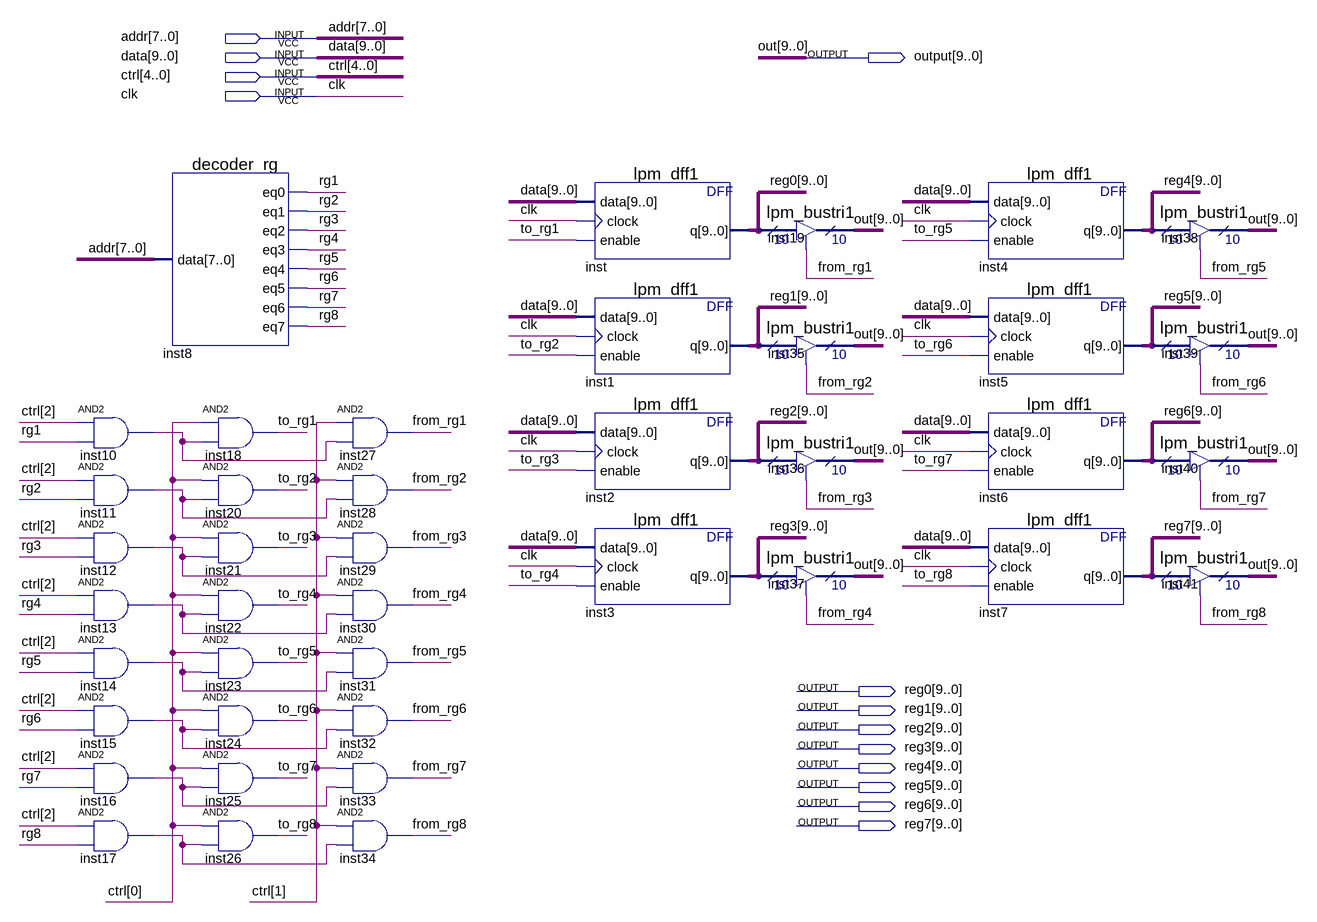
[diagram p0: schematic sheet]
// Quartus schematic Registers.bdf as structural Verilog: 41 symbols, 13 pins
module Registers (
  input  [7:0] addr,
  input  [9:0] data,
  input  [4:0] ctrl,
  input  clk,
  output [9:0] \output ,
  output [9:0] reg0,
  output [9:0] reg1,
  output [9:0] reg2,
  output [9:0] reg3,
  output [9:0] reg4,
  output [9:0] reg5,
  output [9:0] reg6,
  output [9:0] reg7
);

  wire from_rg1, from_rg2, from_rg3, from_rg4, from_rg5, from_rg6, from_rg7, from_rg8, inst10_out,
       inst11_out, inst12_out, inst13_out, inst14_out, inst15_out, inst16_out, inst17_out, rg1, rg2, rg3,
       rg4, rg5, rg6, rg7, rg8, to_rg1, to_rg2, to_rg3, to_rg4, to_rg5, to_rg6, to_rg7, to_rg8;

  and inst10 (inst10_out, ctrl[2], rg1);
  and inst11 (inst11_out, ctrl[2], rg2);
  and inst12 (inst12_out, ctrl[2], rg3);
  and inst13 (inst13_out, ctrl[2], rg4);
  and inst14 (inst14_out, ctrl[2], rg5);
  and inst15 (inst15_out, ctrl[2], rg6);
  and inst16 (inst16_out, ctrl[2], rg7);
  and inst17 (inst17_out, ctrl[2], rg8);
  decoder_rg inst8 (
    .data(addr), .eq0(rg1), .eq1(rg2), .eq2(rg3), .eq3(rg4), .eq4(rg5), .eq5(rg6), .eq6(rg7), .eq7(rg8));
  and inst18 (to_rg1, ctrl[0], inst10_out);
  and inst20 (to_rg2, ctrl[0], inst11_out);
  and inst21 (to_rg3, ctrl[0], inst12_out);
  and inst22 (to_rg4, ctrl[0], inst13_out);
  and inst23 (to_rg5, ctrl[0], inst14_out);
  and inst24 (to_rg6, ctrl[0], inst15_out);
  and inst25 (to_rg7, ctrl[0], inst16_out);
  and inst26 (to_rg8, ctrl[0], inst17_out);
  and inst27 (from_rg1, ctrl[1], inst10_out);
  and inst28 (from_rg2, ctrl[1], inst11_out);
  and inst29 (from_rg3, ctrl[1], inst12_out);
  and inst30 (from_rg4, ctrl[1], inst13_out);
  and inst31 (from_rg5, ctrl[1], inst14_out);
  and inst32 (from_rg6, ctrl[1], inst15_out);
  and inst33 (from_rg7, ctrl[1], inst16_out);
  and inst34 (from_rg8, ctrl[1], inst17_out);
  lpm_dff1 inst (.data(data), .clock(clk), .enable(to_rg1), .q(reg0));
  lpm_dff1 inst1 (.data(data), .clock(clk), .enable(to_rg2), .q(reg1));
  lpm_dff1 inst2 (.data(data), .clock(clk), .enable(to_rg3), .q(reg2));
  lpm_dff1 inst3 (.data(data), .clock(clk), .enable(to_rg4), .q(reg3));
  lpm_bustri1 inst19 (.enabledt(from_rg1), .data(reg0), .tridata(\output ));
  lpm_bustri1 inst35 (.enabledt(from_rg2), .data(reg1), .tridata(\output ));
  lpm_bustri1 inst36 (.enabledt(from_rg3), .data(reg2), .tridata(\output ));
  lpm_bustri1 inst37 (.enabledt(from_rg4), .data(reg3), .tridata(\output ));
  lpm_dff1 inst4 (.data(data), .clock(clk), .enable(to_rg5), .q(reg4));
  lpm_dff1 inst5 (.data(data), .clock(clk), .enable(to_rg6), .q(reg5));
  lpm_dff1 inst6 (.data(data), .clock(clk), .enable(to_rg7), .q(reg6));
  lpm_dff1 inst7 (.data(data), .clock(clk), .enable(to_rg8), .q(reg7));
  lpm_bustri1 inst38 (.enabledt(from_rg5), .data(reg4), .tridata(\output ));
  lpm_bustri1 inst39 (.enabledt(from_rg6), .data(reg5), .tridata(\output ));
  lpm_bustri1 inst40 (.enabledt(from_rg7), .data(reg6), .tridata(\output ));
  lpm_bustri1 inst41 (.enabledt(from_rg8), .data(reg7), .tridata(\output ));

  // Other names for the same wires on the sheet: out[9:0] = \output 
endmodule
